# EAGLE design Aques_click_1_0a (EAGLE 7.6.0)
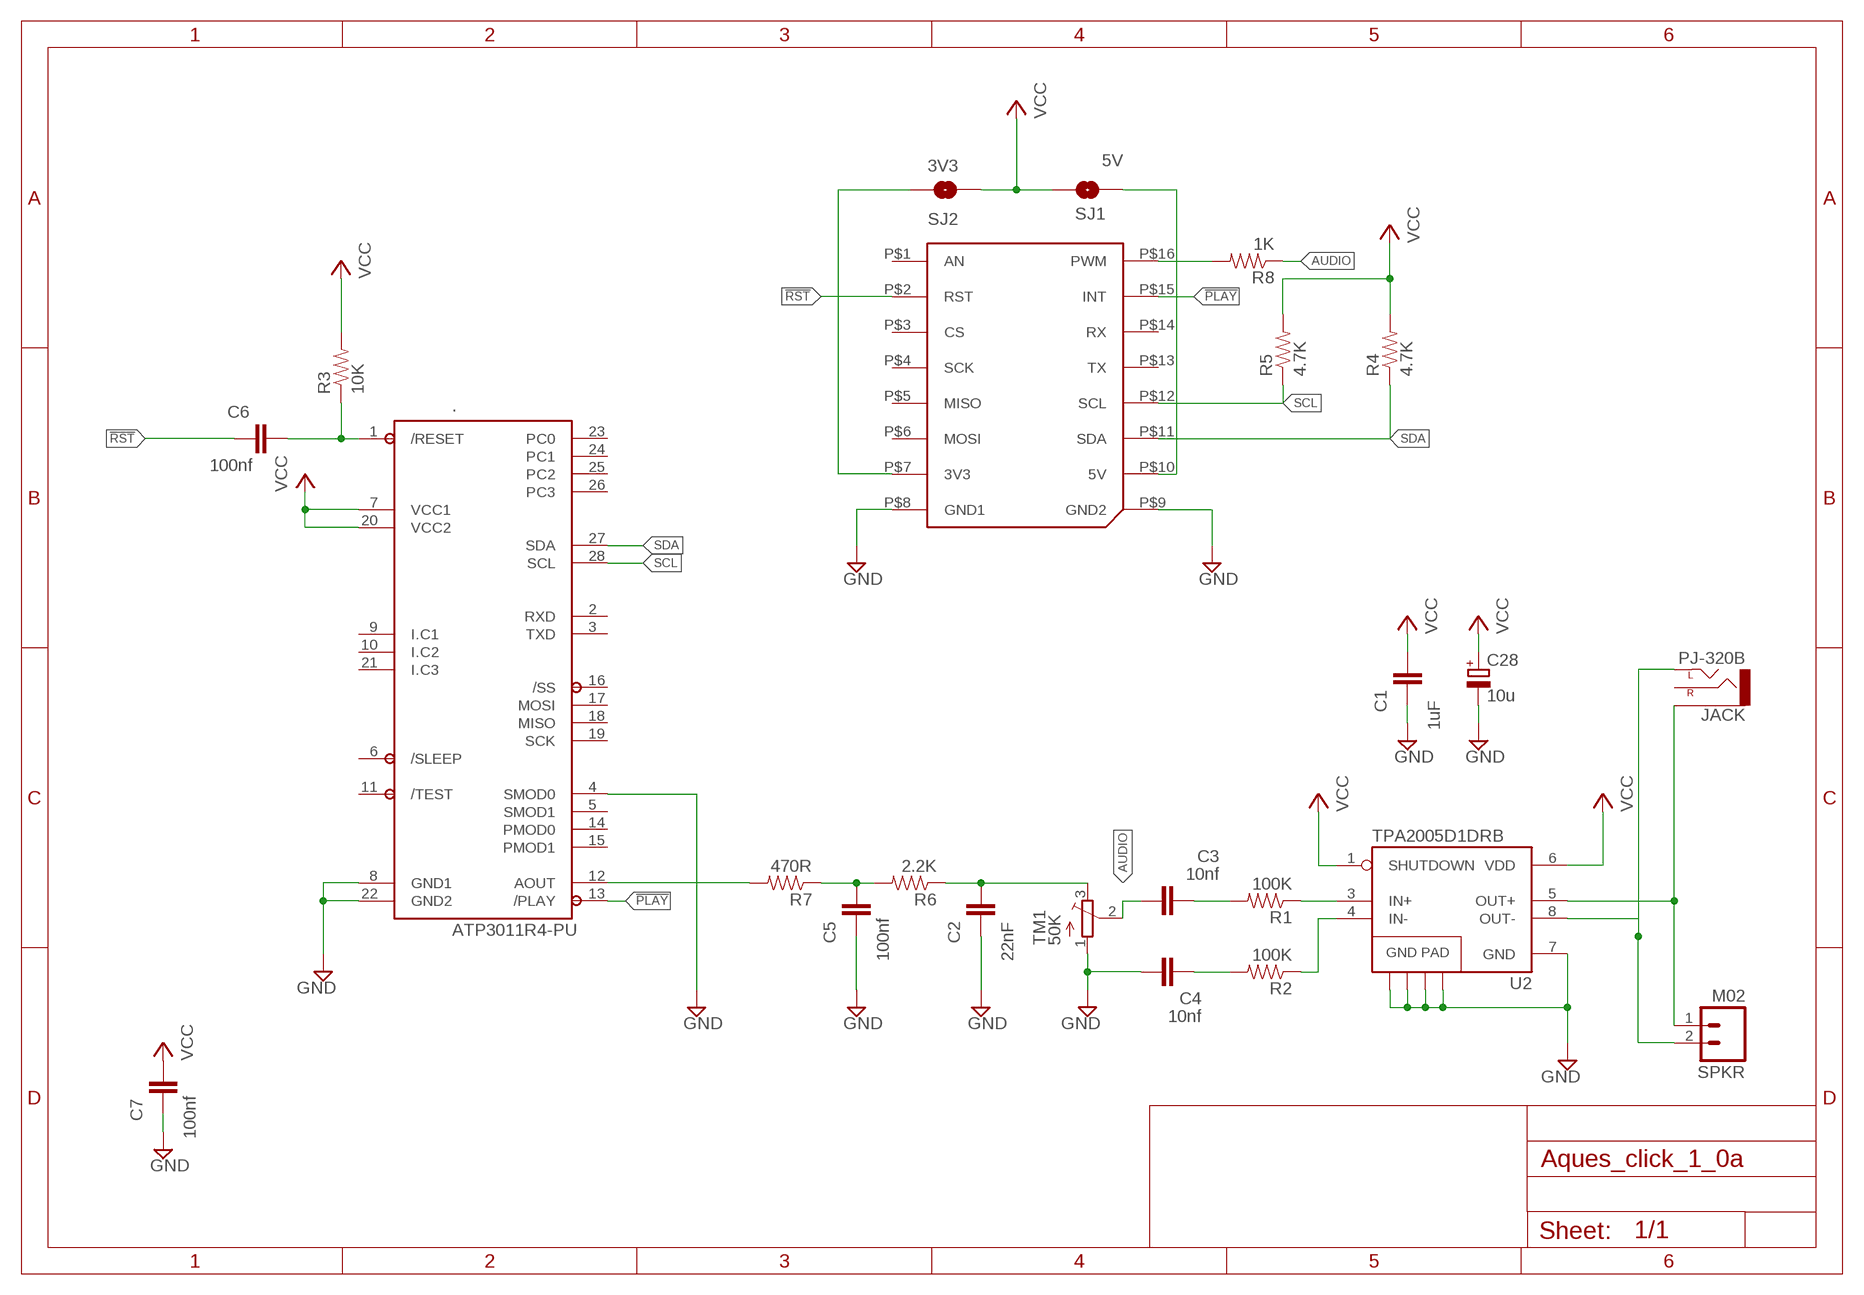
[diagram p0: schematic, sheet 1]

## Parts
.  ATP3011R4-PU  ATMEGA328  [DIP28]
C1  1uF  SPARKFUN_CAP0805  [SPARKFUN_0805]
C2  22nF  SPARKFUN_CAP0805  [SPARKFUN_0805]
C3  10nf  SPARKFUN_CAP0805  [SPARKFUN_0805]
C4  10nf  SPARKFUN_CAP0805  [SPARKFUN_0805]
C5  100nf  SPARKFUN_CAP0805  [SPARKFUN_0805]
C6  100nf  SPARKFUN_CAP0805  [SPARKFUN_0805]
C7  100nf  SPARKFUN_CAP0805  [SPARKFUN_0805]
C28  10u  CPOL-EUA/3216-18R  [A/3216-18R]
CLICK  MIKROE_CLICKLARGE  [MIKROE_BUS_LARGE]
JACK  PJ-320B  [FOOTPRINT]
R1  100K  SPARKFUN_RESISTOR0805-RES  [SPARKFUN_0805]
R2  100K  SPARKFUN_RESISTOR0805-RES  [SPARKFUN_0805]
R3  10K  SPARKFUN_RESISTOR0805-RES  [SPARKFUN_0805]
R4  4.7K  SPARKFUN_RESISTOR0805-RES  [SPARKFUN_0805]
R5  4.7K  SPARKFUN_RESISTOR0805-RES  [SPARKFUN_0805]
R6  2.2K  SPARKFUN_RESISTOR0805-RES  [SPARKFUN_0805]
R7  470R  SPARKFUN_RESISTOR0805-RES  [SPARKFUN_0805]
R8  1K  SPARKFUN_RESISTOR0805-RES  [SPARKFUN_0805]
SJ1  5V  SPARKFUN_SOLDERJUMPERTRACE  [SPARKFUN_SJ_2S-TRACE]
SJ2  3V3  SPARKFUN_SOLDERJUMPERNO  [SPARKFUN_SJ_2S-NO]
SPKR  M02  M02LOCK_LONGPADS  [1X02_LOCK_LONGPADS]
TM1  50K  TRIMPOTTC33X  [TC33X]
U2  TPA2005D1DRB  [QFN-8_PAD]

## Nets
!PLAY: ..13(/PLAY) CLICK.P$15(INT)
!RST: C6.2 CLICK.P$2(RST)
AUDIO: C3.1 R8.1 TM1.2(S)
GND: ..4(SMOD0) ..8(GND1) ..22(GND2) C1.2 C2.2 C4.1 C5.2 C7.2 C28.- CLICK.P$8(GND1) CLICK.P$9(GND2) TM1.1(A) U2.7(GND) U2.10(GND) U2.11(GND) U2.12(GND) U2.13(GND)
N$1: ..1(/RESET) C6.1 R3.1
N$2: JACK.4(SLEEVE) SPKR.1 U2.5(OUT+)
N$3: CLICK.P$7(3V3) SJ2.1
N$4: CLICK.P$10(5V) SJ1.1
N$5: C5.1 R6.2 R7.1
N$6: C2.1 R6.1 TM1.3(E)
N$8: JACK.2(LEFT) SPKR.2 U2.8(OUT-)
N$9: R1.1 U2.3(IN+)
N$10: R2.1 U2.4(IN-)
N$11: C4.2 R2.2
N$12: CLICK.P$16(PWM) R8.2
N$13: C3.2 R1.2
N$16: ..12(AOUT) R7.2
SCL: ..28(SCL) CLICK.P$12(SCL) R5.1
SDA: ..27(SDA) CLICK.P$11(SDA) R4.1
VCC: ..7(VCC1) ..20(VCC2) C1.1 C7.1 C28.+ R3.2 R4.2 R5.2 SJ1.2 SJ2.2 U2.1(SHUTDOWN) U2.6(VDD)
Unconnected: ..2(RXD) ..3(TXD) ..5(SMOD1) ..6(/SLEEP) ..9(I.C1) ..10(I.C2) ..11(/TEST) ..14(PMOD0) ..15(PMOD1) ..16(/SS) ..17(MOSI) ..18(MISO) ..19(SCK) ..21(I.C3) ..23(PC0) ..24(PC1) ..25(PC2) ..26(PC3) CLICK.P$1(AN) CLICK.P$3(CS) CLICK.P$4(SCK) CLICK.P$5(MISO) CLICK.P$6(MOSI) CLICK.P$13(TX) CLICK.P$14(RX) JACK.3(RIGHT)

## Library data of the parts
. = Atmega:ATMEGA328
C1-C7 = DECADE-libraries:SPARKFUN_CAP: Capacitor Standard 0603 ceramic capacitor, and 0.1" leaded capacitor.
C28 = rcl:CPOL-EU: POLARIZED CAPACITOR, European symbol; OC_MOUSER: 74-TMCMA1C106MTRF
CLICK = mikrobus_lib_AQ:MIKROE_CLICK
JACK = PJ320B:PJ-320B; OC_QINGPU: WQ-PJ320B
R1-R8 = DECADE-libraries:SPARKFUN_RESISTOR: Resistor Basic schematic elements and footprints for 0603, 1206, and PTH resistors.
SJ1 SJ2 = DECADE-libraries:SPARKFUN_SOLDERJUMPER: Solder Jumper Standard SMD solder jumper. Used to automate production. Two varients : Normally Open and Normally Closed are the same, but have different paste layers. NC will have a large amount of paste and should jumper during reflow.
SPKR = SparkFun-Connectors:M02: Standard 2-pin 0.1" header. Use with - straight break away headers ( PRT-00116) - right angle break away headers (PRT-00553) - swiss pins (PRT-00743) - machine pins (PRT-00117) - female headers (PRT-00115) Molex polarized connector foot print use with: PRT-08233 with associated crimp pins and housings. 2.54_SCREWTERM for use with PRT-10571. 3.5mm Screw Terminal footprints for PRT-08084 5mm Screw Terminal footprints for use with PRT-08433
TM1 = adafruit:TRIMPOT: SMT trimmer potentiometer part number TC33X http://www.ladyada.net/library/eagle; OC_MOUSER: 652-TC33X-2-503E
U2 = mike-temp:TPA2005D1: 1.4W MONO CLASS-D AUDIO POWER AMPLIFIER The TPA2005D1 is a 1.4-W high efficiency filter-free class-D audio power amplifier in a BGA, QFN, or MSOP package that requires only three external components. Datasheet: http://focus.ti.com/lit/ds/symlink/tpa2005d1.pdf 1.4 W Into 8 ? From a 5V Supply at THD = 10% (Typ) Maximum Battery Life and Minimum Heat Efficiency With an 8-? Speaker: 84% at 400 mW, 79% at 100 mW 2.8-mA Quiescent Current 0.5-mA Shutdown Current Ideal for Wireless or Cellular Handsets and PDAs Capable of Driving an 8-? Speaker (2.5 V ? VDD ? 5.5 V) and a 4-? Speaker (2.5 V ? VDD ? 4.2 V) Only Three External Components Optimized PWM Output Stage Eliminates LC Output Filter Internally Generated 250-kHz Switching Frequency Eliminates Capacitor and Resistor Improved PSRR (-71 dB at 217 Hz) and Wide Supply Voltage (2.5 V to 5.5 V) Eliminates Need for a Voltage Regulator Fully Differential Design Reduces RF Rectification and Eliminates Bypass Capacitor Improved CMRR Eliminates Two Input Coupling Capacitors; OC_MOUSER: 595-TPA2005D1DRBR

## Board
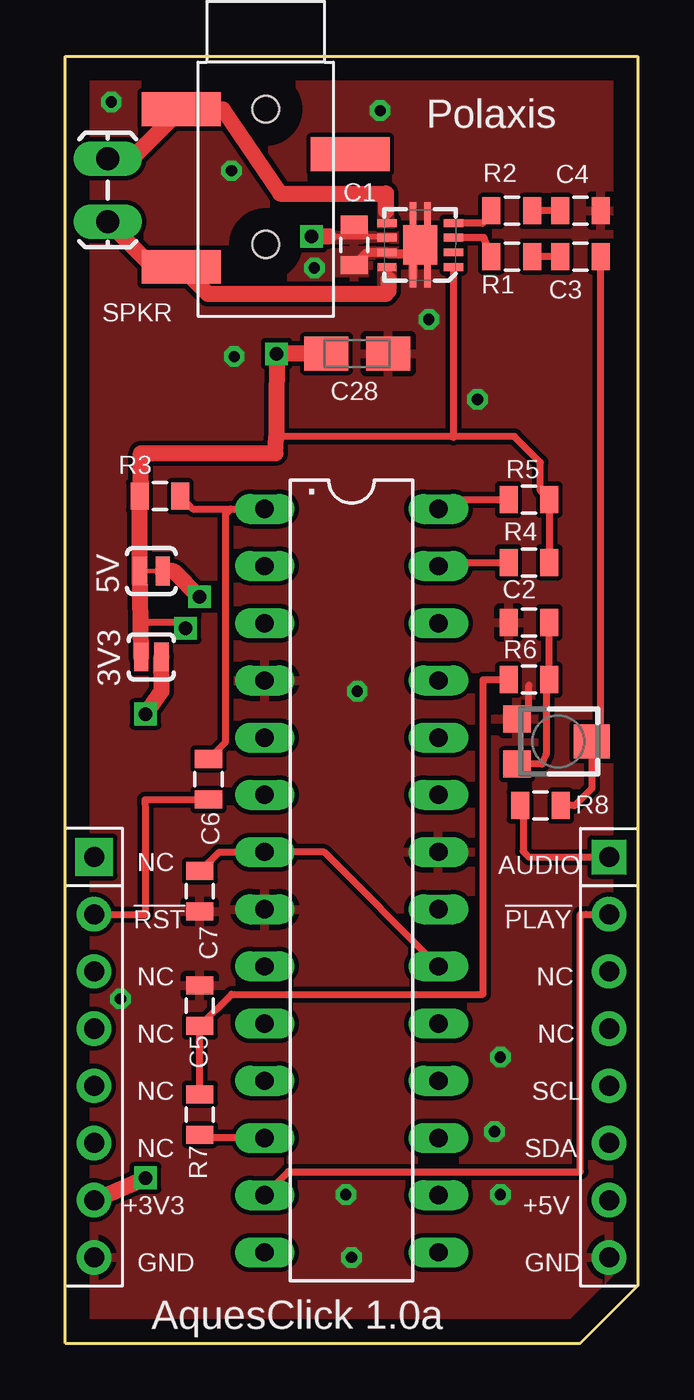
[diagram p1: board, top side]
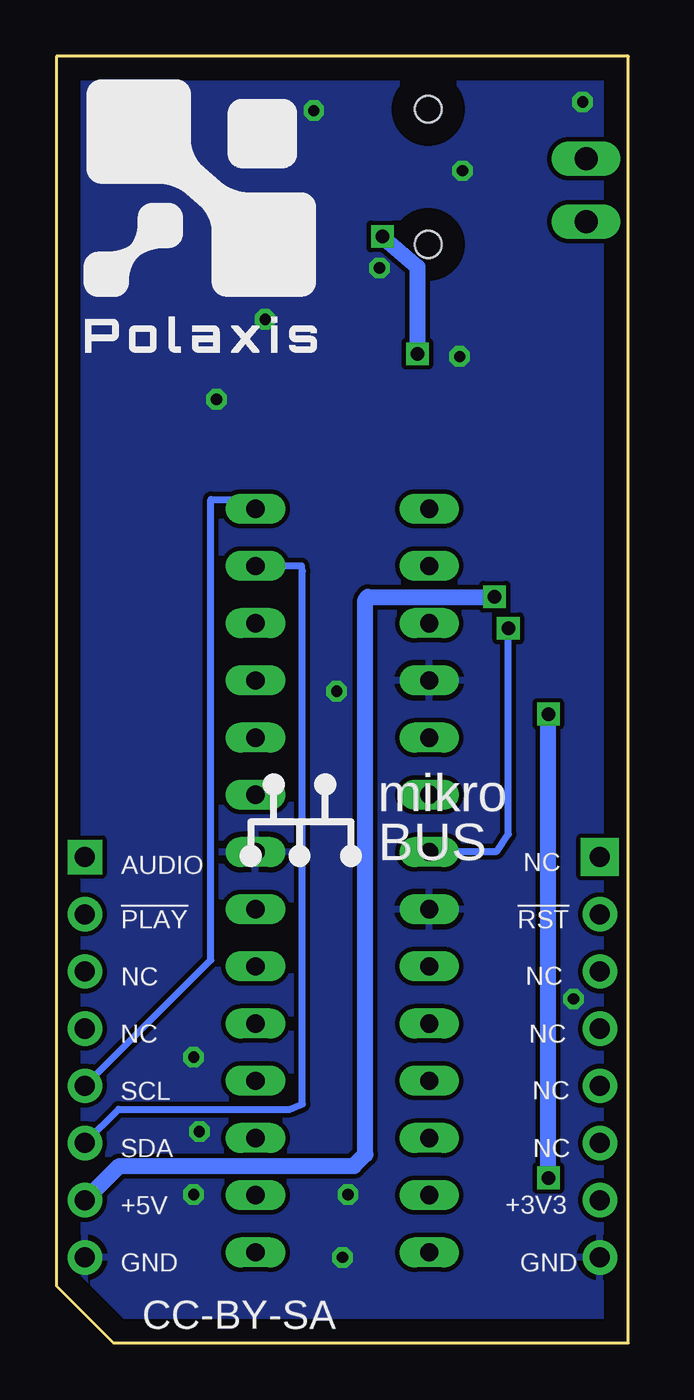
[diagram p2: board, bottom side, seen from below]

Size 25.4 x 57.15 mm. Coordinates in mm from the lower left corner, seen from the top.
Outline: 0,0 22.86,0 25.4,2.54 25.4,57.15
Copper layers (1*16): Top 0.035mm / dielectric 1.5mm / Bottom 0.035mm
Design rules "default": minimum track width 10mil, minimum drill 24mil, track to track 8mil, track to pad 8mil, pad to pad 8mil, via to via 8mil, smd to smd 8mil, copper to edge 40mil, drill to drill 8mil, minimum pad ring 10mil, minimum via ring 8mil, stop-mask expansion 4mil, vias tented up to drill 0mil, thermal gap 10mil

### Footprints (pad centres in the part's own frame; a part is rotated, then mirrored left to right if it is on the bottom)
DIP28 = drill 0.813 long: 1 -16.51,-3.858; 2 -13.97,-3.858; 3 -11.43,-3.858; 4 -8.89,-3.858; 5 -6.35,-3.858; 6 -3.81,-3.858; 7 -1.27,-3.858; 8 1.27,-3.858; 9 3.81,-3.858; 10 6.35,-3.858; 11 8.89,-3.858; 12 11.43,-3.858; 13 13.97,-3.858; 14 16.51,-3.858; 15 16.51,3.858; 16 13.97,3.858; 17 11.43,3.858; 18 8.89,3.858; 19 6.35,3.858; 20 3.81,3.858; 21 1.27,3.858; 22 -1.27,3.858; 23 -3.81,3.858; 24 -6.35,3.858; 25 -8.89,3.858; 26 -11.43,3.858; 27 -13.97,3.858; 28 -16.51,3.858
SPARKFUN_0805 = smd 0.8 x 1.2: 1 -0.9,0; 2 0.9,0
A/3216-18R = smd 1.95 x 1.5: + 1.375,0; - -1.375,0
MIKROE_BUS_LARGE = drill 0.889 pad 1.676 square: P$1 1.27,21.59 | drill 0.889 pad 1.524: P$2 1.27,19.05; P$3 1.27,16.51; P$4 1.27,13.97; P$5 1.27,11.43; P$6 1.27,8.89; P$7 1.27,6.35; P$8 1.27,3.81; P$9 24.13,3.81; P$10 24.13,6.35; P$11 24.13,8.89; P$12 24.13,11.43; P$13 24.13,13.97; P$14 24.13,16.51; P$15 24.13,19.05 | drill 0.889 pad 1.524 square: P$16 24.13,21.59
FOOTPRINT = smd 1.5 x 3.5: 2 9.1,-3.75; 3 4.1,3.75; 4 2.1,-3.75 | hole 1.2: 2.1,0; 8.1,0
SPARKFUN_SJ_2S-TRACE = smd 0.635 x 1.27: 1 -0.508,0; 2 0.508,0
SPARKFUN_SJ_2S-NO = smd 0.635 x 1.27: 1 -0.45,0; 2 0.45,0
1X02_LOCK_LONGPADS = drill 1.016 long: 1 -0.127,0; 2 2.667,0
TC33X = smd 1.2 x 1.2: 1 -1,-1.825; 3 1,-1.825 | smd 1.5 x 1.6: 2 0,1.5
QFN-8_PAD = smd 0.35 x 0.85: 1 -0.975,-1.475; 2 -0.325,-1.475; 3 0.325,-1.475; 4 0.975,-1.475; 5 0.975,1.475; 6 0.325,1.475; 7 -0.325,1.475; 8 -0.975,1.475 | smd 1.75 x 1.5: 9 0,0 | smd 1.025 x 0.28: 10 -1.387,-0.325; 11 1.387,-0.325; 12 1.387,0.325; 13 -1.387,0.325

### Placement (x,y rotation side)
.  12.7,20.54 270 top
C1  12.83,48.77 270 top
C2  20.57,32 180 top
C3  22.86,48.26 180 top
C4  22.86,50.29 180 top
C5  5.97,14.99 90 top
C6  6.35,25.04 270 top
C7  5.97,20.07 270 top
C28  12.95,43.94 180 top
CLICK  0,0 0 top
JACK  8.89,56.9 270 top
R1  19.81,48.26 0 top
R2  19.81,50.29 0 top
R3  4.19,37.62 180 top
R4  20.57,34.67 0 top
R5  20.57,37.47 0 top
R6  20.57,29.46 180 top
R7  5.97,10.16 270 top
R8  21.08,23.88 180 top
SJ1  3.81,34.29 180 top
SJ2  3.81,30.48 180 top
SPKR  1.88,52.48 270 top
TM1  21.87,26.72 270 top
U2  15.75,48.77 90 top

### Tracks (layer width: path | path; a pad name or v marks a point on that pad's centre or on a via)
!PLAY
  Top 0.305: ..13 9.89,7.62 22.86,7.62 22.86,19.05 23.11,19.05 CLICK.P$15
!RST
  Top 0.305: CLICK.P$2 3.56,19.05 3.56,23.62 3.53,24.14 C6.2
AUDIO
  Top 0.305: R8.1 22.61,23.88 23.37,24.64 TM1.2 23.76,26.84 C3.1
GND  (via drill 0.5 pad 0.25)
  Top 0.305: TM1.1 20.57,28.25 20.57,29.21
  Top 0.406: U2.13 15.42,48.33 15.37,48.39 14.33,48.39 U2.7 13.4,48.44 C1.2
  other vias: 12.95,28.96 12.7,3.81 19.3,12.7 19.05,9.4 12.45,6.6 19.3,6.6 2.44,15.29 13.97,54.74 18.29,41.91 7.49,43.81 2.03,55.12 7.37,52.07 16.13,45.47 11.05,47.75
  pour Bottom: -2.03,58.67 27.43,58.67 27.43,-2.54 -2.03,-2.54
  pour Top: -1.27,-1.52 26.42,-1.52 26.42,58.17 -1.27,58.17 -1.27,57.91
  pour Top (no thermals): 11.94,47.14 11.94,47.37 13.46,47.37 13.46,48.13 15.11,48.13 15.11,48.77 15.04,48.69 12.34,48.69 12.24,48.59 11.79,48.59 11.66,48.46 11.51,48.46 11.58,48.39 11.58,47.14
N$1
  Top 0.305: C6.1 7.11,26.71 7.11,36.83 7.33,37.05 ..1 5.66,37.05 R3.1
N$2
  Top 0.254: 14.22,50.29 14.27,50.29 U2.5
  Top 0.7: 14.22,50.29 14.22,51.05 9.53,51.05 6.99,54.8 JACK.4 2.95,52.6 SPKR.1
  pour Top (no thermals): 13.84,49.53 14.61,49.53 14.58,51.16 14.45,51.31 13.84,51.31
N$3  (via drill 0.6)
  Top 0.7: CLICK.P$7 v3.56,7.34 | v3.56,27.94 4.27,28.96 SJ2.1
  Bottom 0.7: v3.56,7.34 v3.56,27.94
N$4  (via drill 0.6)
  Top 0.7: v5.94,33.15 4.8,34.29 SJ1.1
  Bottom 0.7: CLICK.P$10 22.61,7.87 12.19,7.87 11.68,8.38 11.68,33.02 11.56,33.15 v5.94,33.15
N$5
  Top 0.305: R6.2 18.54,29.46 18.54,22.99 18.54,15.49 7.38,15.49 C5.1 R7.1
N$6
  Top 0.305: C2.1 R6.1 21.34,29.46 21.34,26.16 21.15,25.72 TM1.3
N$8
  Top 0.254: U2.8 14.35,47.72 14.35,47.24
  Top 0.7: SPKR.2 3.89,47.8 JACK.2 6.33,46.61 14.22,46.61 14.35,46.74 14.35,47.24
  pour Top (no thermals): 13.84,47.88 13.84,46.86 14.71,46.86 14.71,47.88
N$9
  Top 0.305: R1.1 18.57,49.1 U2.3
N$10
  Top 0.305: R2.1 18.52,49.73 U2.4
N$11
  Top 0.305: C4.2 R2.2
N$12
  Top 0.305: R8.2 20.32,23.74 20.32,21.84 20.57,21.59 CLICK.P$16
N$13
  Top 0.305: C3.2 R1.2
N$16
  Top 0.305: ..12 5.97,9.11 R7.2
SCL
  Top 0.305: ..28 16.97,37.47 R5.1
  Bottom 0.305: 16.53,37.08 ..28 16.89,37.46 18.54,37.47 18.54,17.02 CLICK.P$12
SDA
  Top 0.305: ..27 16.72,34.67 R4.1
  Bottom 0.305: CLICK.P$11 22.63,10.39 15.01,10.39 14.48,10.62 14.48,34.29 14.51,34.51 ..27
VCC  (via drill 0.6)
  Top 0.254: U2.6 14.22,49.15 12.83,49.15 | 12.83,49.15 11.68,49.15 | 12.83,49.78 12.83,49.15
  Top 0.305: SJ1.2 3.36,34.23 | ..20 11.48,21.81 ..7 6.82,21.81 C7.1 | R4.2 R5.2 21.08,37.86 21.08,39.12 19.93,40.27 17.14,40.27 | v5.33,31.75 5.09,32 3.34,32 | 17.14,40.27 9.36,40.27 | U2.1 17.22,40.23 17.14,40.27
  Top 0.406: C1.1 12.83,49.78
  Top 0.7: SJ2.2 3.34,32 SJ1.2 R3.2 3.35,38.24 3.35,39.52 9.32,39.52 9.36,40.27 9.36,41.37 v9.37,43.94 C28.+ | 11.68,49.15 v10.92,49.15
  Bottom 0.305: ..7 8.56,21.84 5.84,21.84 5.33,22.61 v5.33,31.75
  Bottom 0.7: v10.92,49.15 9.37,47.8 v9.37,43.94
  pour Top (no thermals): 11.68,48.9 11.73,48.82 14.78,48.82 14.81,48.84 14.81,49.35 11.99,49.35 11.84,49.5 11.63,49.5 11.68,49.45

### Text on the board
tNames: Polaxis | AquesClick 1.0a
bNames: CC-BY-SA